# EAGLE schematic camera-parts (EAGLE 7.7.0)
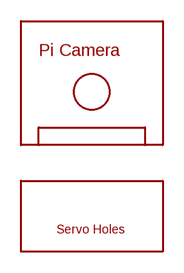
[diagram p0: schematic, sheet 1]

## Parts
U$1  CAMERA-MODULE  [CAMERA-MODULE]
U$5  SERVO-HOLES  [SERVO-HOLES]

## Library data of the parts
U$1 = 0_Rpi3_RevA:CAMERA-MODULE
U$5 = 0-chirimen:SERVO-HOLES